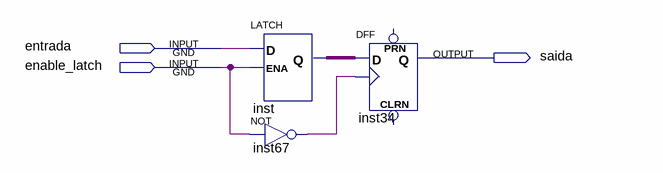
[diagram p0: schematic sheet]
// Quartus schematic Barramento_1x.bdf as structural Verilog: 3 symbols, 3 pins
module Barramento_1x (
  input  entrada,
  input  enable_latch,
  output saida
);

  wire inst67_out, inst_q;

  LATCH inst (.D(entrada), .ENA(enable_latch), .Q(inst_q));
  not inst67 (inst67_out, enable_latch);
  DFF inst34 (.CLK(inst67_out), .D(inst_q), .Q(saida));  // open: CLRN, PRN
endmodule
